# Altium schematic sheet [7] Power.SchDoc: On / Off Controller
size A3; SheetNumber: 7; SheetTotal: 7
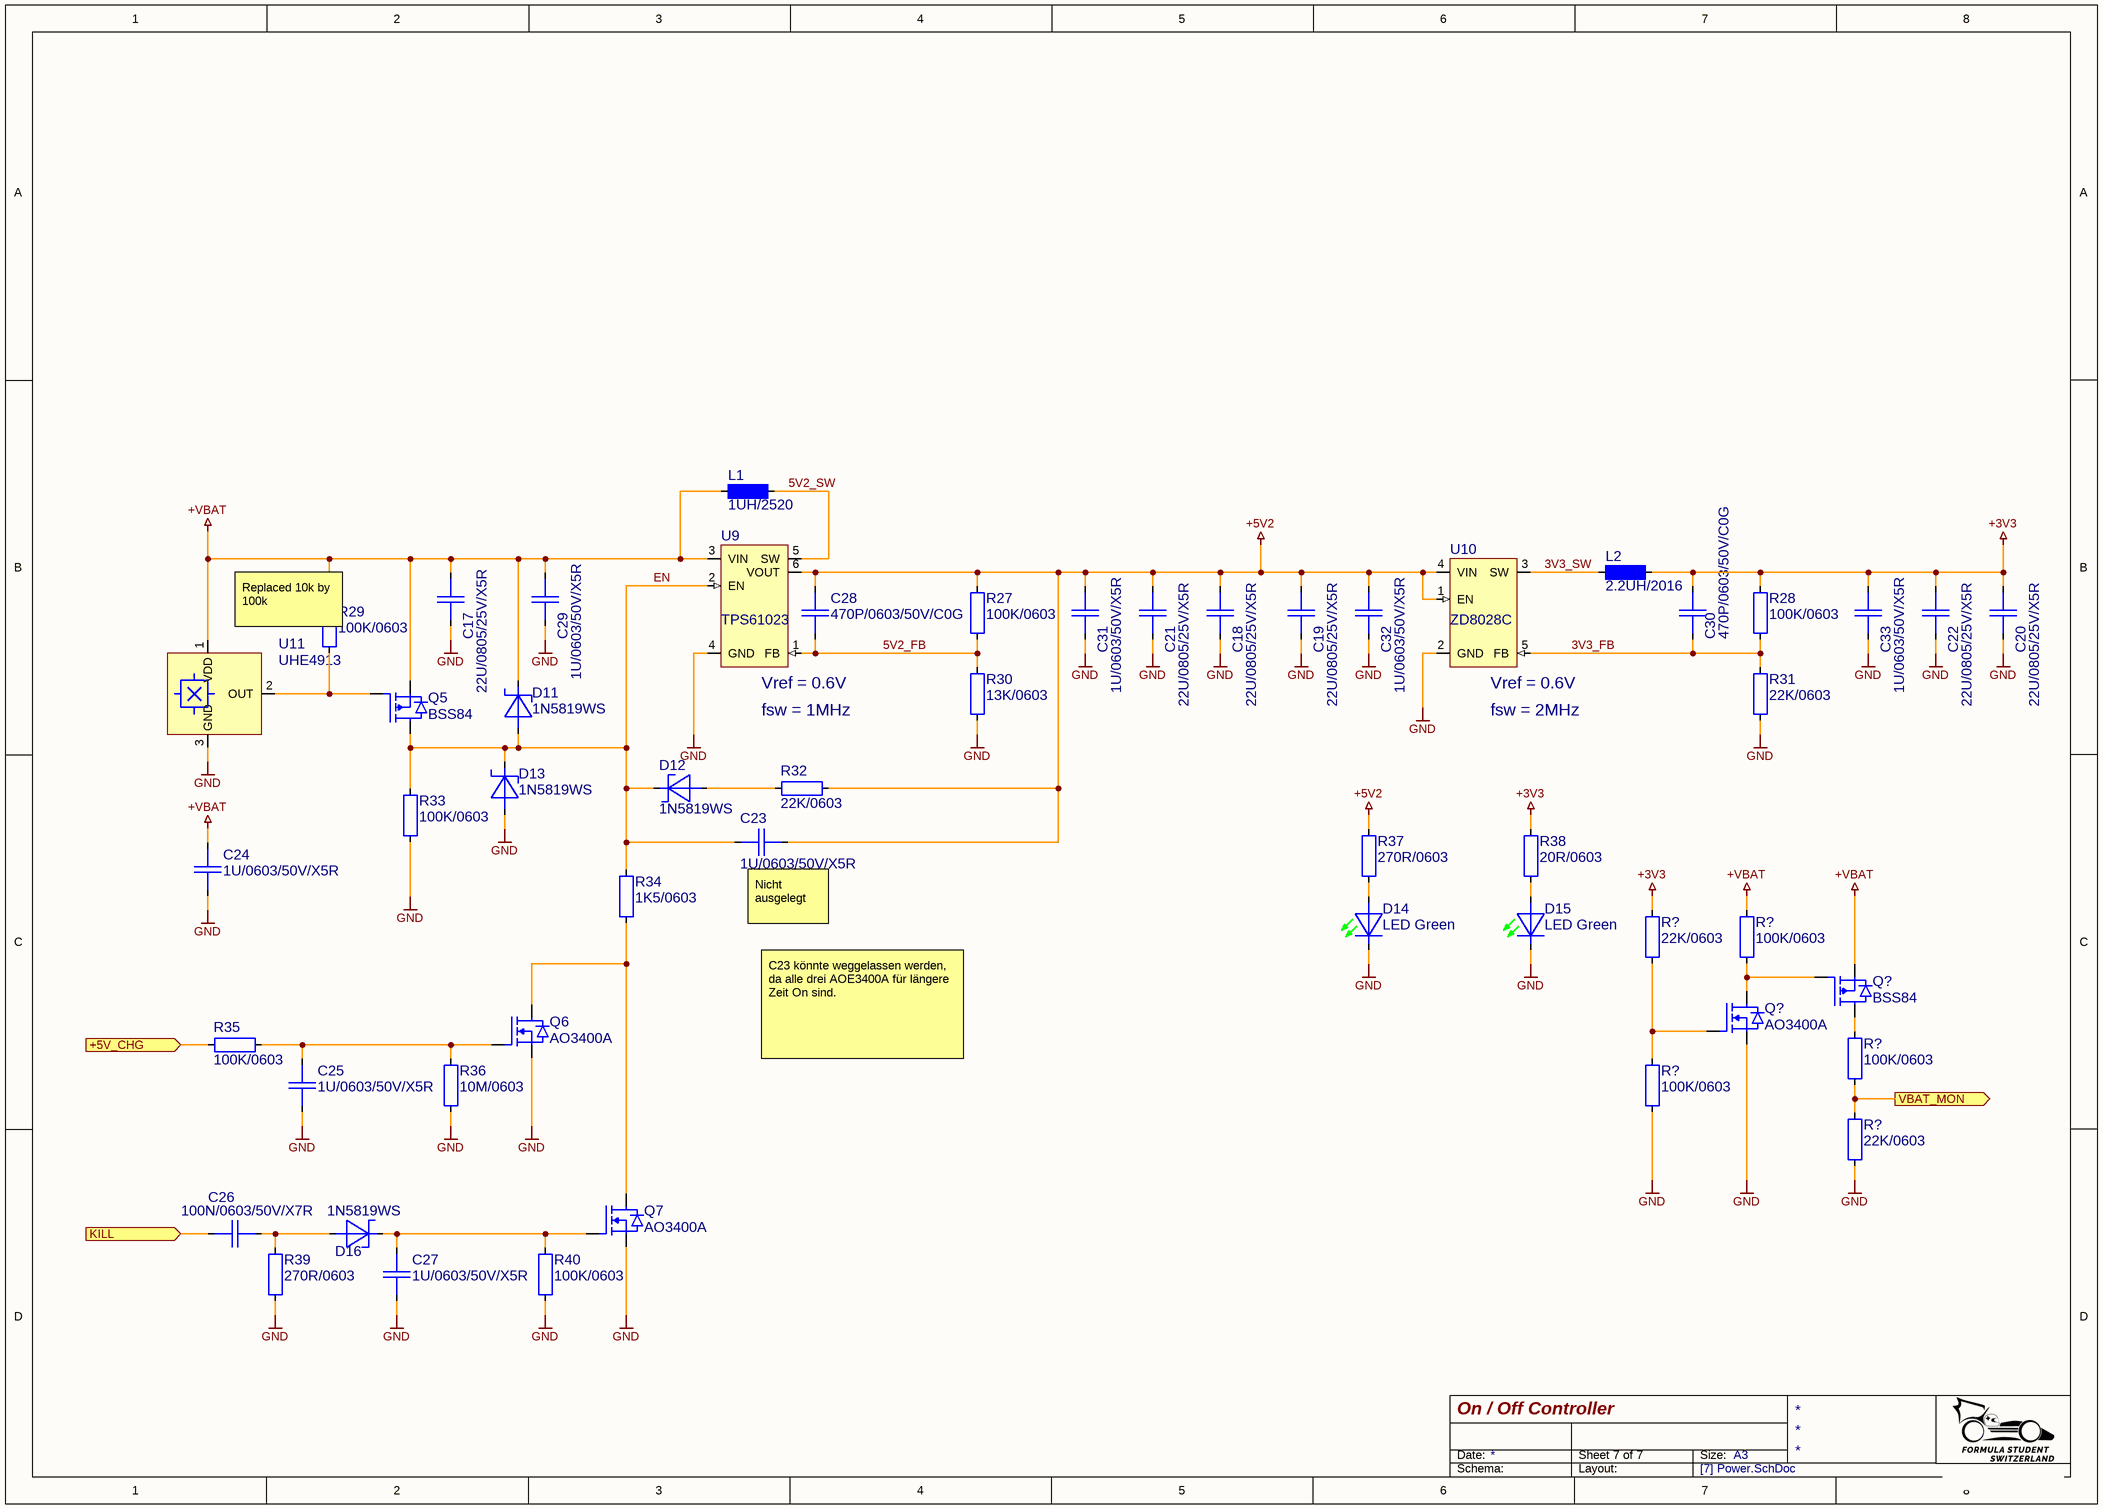
[diagram p0: [7] Power.SchDoc]

## Parts
(Parts that share a designator on the sheet are numbered #1, #2 ... from top to bottom, then left to right.)
C17  22U/0805/25V/X5R  [CAP0805_X7R]
C18  22U/0805/25V/X5R  [CAP0805_X7R]
C19  22U/0805/25V/X5R  [CAP0805_X7R]
C20  22U/0805/25V/X5R  [CAP0805_X7R]
C21  22U/0805/25V/X5R  [CAP0805_X7R]
C22  22U/0805/25V/X5R  [CAP0805_X7R]
C23  1U/0603/50V/X5R  [CAP0603_X7R]
C24  1U/0603/50V/X5R  [CAP0603_X7R]
C25  1U/0603/50V/X5R  [CAP0603_X7R]
C26  100N/0603/50V/X7R  [CAP0603_X7R]
C27  1U/0603/50V/X5R  [CAP0603_X7R]
C28  470P/0603/50V/C0G  [CAP0603_C0G]
C29  1U/0603/50V/X5R  [CAP0603_X7R]
C30  470P/0603/50V/C0G  [CAP0603_C0G]
C31  1U/0603/50V/X5R  [CAP0603_X7R]
C32  1U/0603/50V/X5R  [CAP0603_X7R]
C33  1U/0603/50V/X5R  [CAP0603_X7R]
D11  1N5819WS  [SOD2513X100]
D12  1N5819WS  [SOD2513X100]
D13  1N5819WS  [SOD2513X100]
D14  LED Green  [LED0805_GREEN]
D15  LED Green  [LED0805_GREEN]
D16  1N5819WS  [SOD2513X100]
L1  1UH/2520  [INDM2520X10]
L2  2.2UH/2016  [INDM2016X10]
Q5  BSS84  [SOT2395P280X125-3-SE]
Q6  AO3400A  [SOT2395P280X125-3-SE]
Q7  AO3400A  [SOT2395P280X125-3-SE]
Q?#1  BSS84  [SOT2395P280X125-3-SE]
Q?#2  AO3400A  [SOT2395P280X125-3-SE]
R27  100K/0603  [R0603-0.40-WW]
R28  100K/0603  [R0603-0.40-WW]
R29  100K/0603  [R0603-0.40-WW]
R30  13K/0603  [R0603-0.40-WW]
R31  22K/0603  [R0603-0.40-WW]
R32  22K/0603  [R0603-0.40-WW]
R33  100K/0603  [R0603-0.40-WW]
R34  1K5/0603  [R0603-0.40-WW]
R35  100K/0603  [R0603-0.40-WW]
R36  10M/0603  [R0603-0.40-WW]
R37  270R/0603  [R0603-0.40-WW]
R38  20R/0603  [R0603-0.40-WW]
R39  270R/0603  [R0603-0.40-WW]
R40  100K/0603  [R0603-0.40-WW]
R?#1  22K/0603  [R0603-0.40-WW]
R?#2  100K/0603  [R0603-0.40-WW]
R?#3  100K/0603  [R0603-0.40-WW]
R?#4  100K/0603  [R0603-0.40-WW]
R?#5  22K/0603  [R0603-0.40-WW]
U9  TPS61023  [SOT50P160X60-6-SE]
U10  ZD8028C  [SOT2395P280X125-5-SW]
U11  UHE4913  [SOT2395P280X125-3-SE]

## Ports
+5V_CHG (in), KILL (in), VBAT_MON (out)

## Nets
+3V3: C20.1 C22.1 C30.1 C33.2 L2.2 R28.1 R38.1 R?#1.1
+5V2: C18.1 C19.1 C21.1 C23.2 C28.1 C31.2 C32.2 R27.1 R32.2 R37.1 U9.6(VOUT) U10.1(EN) U10.4(VIN)
+VBAT: C17.1 C24.1 C29.2 D11.1 L1.1 Q5.2(SOURCE) Q?#1.2(SOURCE) R29.1 R?#2.1 U9.3(VIN) U11.1(VDD)
GND: C17.2 C18.2 C19.2 C20.2 C21.2 C22.2 C24.2 C25.2 C27.2 C29.1 C31.1 C32.1 C33.1 D13.2 D14.1 D15.1 Q6.2(SOURCE) Q7.2(SOURCE) Q?#2.2(SOURCE) R30.1 R31.2 R33.2 R36.2 R39.2 R40.2 R?#4.2 R?#5.2 U9.4(GND) U10.2(GND) U11.3(GND)
3V3_FB: C30.2 R28.2 R31.1 U10.5(FB)
3V3_SW: L2.1 U10.3(SW)
5V2_FB: C28.2 R27.2 R30.2 U9.1(FB)
5V2_SW: L1.2 U9.5(SW)
+5V_CHG: R35.1 ; port +5V_CHG
EN: C23.1 D11.2 D12.1 D13.1 Q5.3(DRAIN) R33.1 R34.1 U9.2(EN)
KILL: C26.1 ; port KILL
VBAT_MON: R?#3.2 R?#5.1 ; port VBAT_MON
NetC25_1: C25.1 Q6.1(GATE) R35.2 R36.1
NetC26_2: C26.2 D16.2 R39.1
NetC27_1: C27.1 D16.1 Q7.1(GATE) R40.1
NetD12_2: D12.2 R32.1
NetD14_2: D14.2 R37.2
NetD15_2: D15.2 R38.2
NetQ5_1: Q5.1(GATE) R29.2 U11.2(OUT)
NetQ6_3: Q6.3(DRAIN) Q7.3(DRAIN) R34.2
NetQ?#1_1: Q?#1.1(GATE) Q?#2.3(DRAIN) R?#2.2
NetQ?#1_3: Q?#1.3(DRAIN) R?#3.1
NetQ?#2_1: Q?#2.1(GATE) R?#1.2 R?#4.1

## Notes on the sheet
- (near R29) Replaced 10k by 100k
- (near U9) Vref = 0.6V
- fsw = 1MHz
- (near U10) Vref = 0.6V
- (near U10) fsw = 2MHz
- (near C23) Nicht ausgelegt
- C23 könnte weggelassen werden, da alle drei AOE3400A für längere Zeit On sind.
- Date:
- Size:
- A3
- Schema:
- Layout:

## Library data of the parts
C17-C22 = 22U/0805/25V/X5R: CAP SM 0805 22uF 25V X5R; Manufacturer: GENERIC; Absolute Value: 2.2E-5; Part Number: 22U/0805/25V/X5R; Package: 805; Value: 22uF; Manufacturer Part Number 3: CL21A226MAQNNNE; Supplier 3: LCSC; Supplier Part Number 3: C45783; JLC Type: Basic
C23-C25 C27 C29 C31-C33 = 1U/0603/50V/X5R: CAP SM 0603 1.0uF 50V X5R; Manufacturer: GENERIC; Absolute Value: 1E-6; Part Number: 1U/0603/50V/X5R; Package: 603; Value: 1.0uF; Manufacturer Part Number 3: CL10A105KB8NNNC; Supplier 3: LCSC; Supplier Part Number 3: C15849; JLC Type: Basic
C26 = 100N/0603/50V/X7R: CAP SM 0603 100nF 50V X7R; Manufacturer: GENERIC; Manufacturer 1: YAGEO; Manufacturer Part Number 1: CC0603KPX7R9BB104; Absolute Value: 1E-7; Part Number: 100N/0603/50V/X7R; Package: 603; Value: 100nF; HelpURL: https://www.yageo.com/upload/media/product/app/datasheet/mlcc/upy-gphc_x7r_6_3v-to-250v.pdf; Supplier 1: Digi-Key; Supplier Part Number 1: 311-3567-1-ND; Manufacturer 2: YAGEO; Manufacturer Part Number 2: CC0603MRX7R9BB104; Supplier 2: Digi-Key; Supplier Part Number 2: 311-4110-1-ND; Manufacturer Part Number 3: CC0603KRX7R9BB104; Supplier 3: LCSC; Supplier Part Number 3: C14663; JLC Type: Basic
C28 C30 = 470P/0603/50V/C0G: CAP SM 0603 470pF 50V C0G; Manufacturer: GENERIC; Manufacturer 1: YAGEO; Manufacturer Part Number 1: CC0603JRNPO9BN471; Absolute Value: 4.7E-10; Part Number: 470P/0603/50V/C0G; Package: 603; Value: 470pF; HelpURL: https://www.yageo.com/upload/media/product/productsearch/datasheet/mlcc/UPY-GP_NP0_16V-to-50V_18.pdf; Supplier 1: Digi-Key; Supplier Part Number 1: 311-1520-1-ND; Manufacturer 2: YAGEO; Manufacturer Part Number 2: CC0603KRNPO9BN471; Supplier 2: Digi-Key; Supplier Part Number 2: 311-4038-1-ND; Manufacturer Part Number 3: GCM1885C1H471JA16D; Supplier 3: LCSC; Supplier Part Number 3: C126566; JLC Type: Extended
D11-D13 D16 = 1N5819WS: 40V 600mV@1A 1A SOD-323 Schottky Barrier Diodes (SBD) ROHS; Manufacturer: GENERIC; Part Number: 1N5819WS; Package: SOD323; Value: 1N5819WS; Absolute Value: 40V; HelpURL: https://datasheet.lcsc.com/lcsc/2204281430_Guangdong-Hottech-1N5819WS_C191023.pdf; Manufacturer 3: Guangdong Hottech; Manufacturer Part Number 3: 1N5819WS; Supplier 3: LCSC; Supplier Part Number 3: C191023; JLC Type: Basic
D14 D15 = LED Green 0805: Generic LED Green 0805; Manufacturer 1: Würth; Manufacturer Part Number 1: 150080GS75000; Part Number: LED Green 0805; Manufacturer: GENERIC; Package: 805; Value: Green; Absolute Value: Green; HelpURL: https://www.we-online.com/katalog/datasheet/150060VS75000.pdf; Supplier 1: Digi-Key; Supplier Part Number 1: 732-4983-1-ND; Manufacturer 3: Hubei KENTO Elec; Manufacturer Part Number 3: KT-0805G; Supplier 3: LCSC; Supplier Part Number 3: C2297; JLC Type: Basic
L1 = 1UH/2520: 1UH 2520 Shielded Inductor SMD; Manufacturer: GENERIC; Manufacturer 1: INPAQ Technology Co., Ltd; Manufacturer Part Number 1: WIP252010S-1R0MLDG; Absolute Value: 1E-6; Part Number: 1UH/2520; Package: 2520 metric; Value: 1UH; HelpURL: https://mm.digikey.com/Volume0/opasdata/d220001/medias/docus/5561/WIP252010S%20L%20Series.pdf; Supplier 1: Digi-Key; Supplier Part Number 1: 3526-WIP252010S-1R0MLDGCT-ND; Manufacturer 3: INPAQ; Manufacturer Part Number 3: WIP252012P-1R0ML; Supplier 3: LCSC; Supplier Part Number 3: C315711; JLC Type: Extended
L2 = 2.2UH/2016: 2.2UH 2016 Shielded Inductor SMD; Manufacturer: GENERIC; Manufacturer 1: INPAQ Technology Co., Ltd; Manufacturer Part Number 1: WIP201610S-2R2MLDG; Absolute Value: 2.2E-6; Part Number: 2.2UH/2016; Package: 2016 metric; Value: 2.2UH; HelpURL: https://mm.digikey.com/Volume0/opasdata/d220001/medias/docus/5561/WIP201610S%20L%20Series.pdf; Supplier 1: Digi-Key; Supplier Part Number 1: 3526-WIP201610S-2R2MLDGCT-ND; Manufacturer 3: INPAQ; Manufacturer Part Number 3: WIP201610P-2R2ML; Supplier 3: LCSC; Supplier Part Number 3: C315717; JLC Type: Extended
Q5 Q?#1 = BSS84: 50V P-Channel MOSFET; Manufacturer: GENERIC; Manufacturer 1: Good-Ark Semiconductor; Part Number: BSS84; Package: SOT23; HelpURL: https://goodarksemi.com/docs/datasheets/mosfets/BSS84.pdf; Manufacturer Part Number 1: BSS84; Supplier 1: Digi-Key; Supplier Part Number 1: 4786-BSS84CT-ND; Manufacturer 3: Jiangsu Changjing Electronics Technology Co., Ltd.; Manufacturer Part Number 3: BSS84; Supplier 3: LCSC; Supplier Part Number 3: C114481; JLC Type: Extended
Q6 Q7 Q?#2 = AO3400A: 30V N-Channel MOSFET; Manufacturer: Alpha & Omega Semiconductor; Part Number: AO3400A; Package: SOT23; HelpURL: https://aosmd.com/res/data_sheets/AO3400A.pdf; Manufacturer 3: Alpha & Omega Semiconductor; Manufacturer Part Number 3: AO3400A; Supplier 3: LCSC; Supplier Part Number 3: C20917; JLC Type: Basic
R27-R29 R33 R35 R40 R?#2-R?#4 = 100K/0603: RES SM 0603 100K; Manufacturer: GENERIC; Manufacturer 1: YAGEO; Manufacturer Part Number 1: RC0603FR-13100KL; Absolute Value: 100000; Part Number: 100K/0603; Package: 0603; Value: 100K; HelpURL: https://www.yageo.com/upload/media/product/productsearch/datasheet/rchip/PYu-RC_Group_51_RoHS_L_12.pdf; Supplier 1: Digi-Key; Supplier Part Number 1: 13-RC0603FR-13100KLCT-ND; Manufacturer 2: YAGEO; Manufacturer Part Number 2: RC0603FR-10100KL; Supplier 2: Digi-Key; Supplier Part Number 2: 13-RC0603FR-10100KLCT-ND; Manufacturer 3: UNI-ROYAL(Uniroyal Elec); Manufacturer Part Number 3: 0603WAF1003T5E; Supplier 3: LCSC; Supplier Part Number 3: C25803; JLC Type: Basic
R30 = 13K/0603: RES SM 0603 13K; Manufacturer: GENERIC; Manufacturer 1: YAGEO; Manufacturer Part Number 1: RC0603FR-1313KL; Absolute Value: 13000; Part Number: 13K/0603; Package: 0603; Value: 13K; HelpURL: https://www.yageo.com/upload/media/product/productsearch/datasheet/rchip/PYu-RC_Group_51_RoHS_L_12.pdf; Supplier 1: Digi-Key; Supplier Part Number 1: 13-RC0603FR-1313KLCT-ND; Manufacturer 2: YAGEO; Manufacturer Part Number 2: RC0603FR-1013KL; Supplier 2: Digi-Key; Supplier Part Number 2: 13-RC0603FR-1013KLCT-ND; Manufacturer 3: UNI-ROYAL(Uniroyal Elec); Manufacturer Part Number 3: 0603WAF1302T5E; Supplier 3: LCSC; Supplier Part Number 3: C22797; JLC Type: Basic
R31 R32 R?#1 R?#5 = 22K/0603: RES SM 0603 22K; Manufacturer: GENERIC; Manufacturer 1: YAGEO; Manufacturer Part Number 1: RC0603FR-1322KL; Absolute Value: 22000; Part Number: 22K/0603; Package: 0603; Value: 22K; HelpURL: https://www.yageo.com/upload/media/product/app/datasheet/rchip/pyu-rc_group_51_rohs_l.pdf; Supplier 1: Digi-Key; Supplier Part Number 1: 13-RC0603FR-1322KLCT-ND; Manufacturer 2: YAGEO; Manufacturer Part Number 2: RC0603FR-1022KL; Supplier 2: Digi-Key; Supplier Part Number 2: 13-RC0603FR-1022KLCT-ND; Manufacturer 3: UNI-ROYAL(Uniroyal Elec); Manufacturer Part Number 3: 0603WAF2202T5E; Supplier 3: LCSC; Supplier Part Number 3: C31850; JLC Type: Basic
R34 = 1K5/0603: RES SM 0603 1K5; Manufacturer: GENERIC; Manufacturer 1: YAGEO; Manufacturer Part Number 1: RC0603FR-131K5L; Absolute Value: 1500; Part Number: 1K5/0603; Package: 0603; Value: 1K5; HelpURL: https://www.yageo.com/upload/media/product/app/datasheet/rchip/pyu-rc_group_51_rohs_l.pdf; Supplier 1: Digi-Key; Supplier Part Number 1: 13-RC0603FR-131K5LCT-ND; Manufacturer 2: YAGEO; Manufacturer Part Number 2: RC0603FR-101K5L; Supplier 2: Digi-Key; Supplier Part Number 2: 13-RC0603FR-101K5LCT-ND; Manufacturer 3: UNI-ROYAL(Uniroyal Elec); Manufacturer Part Number 3: 0603WAF1501T5E; Supplier 3: LCSC; Supplier Part Number 3: C22843; JLC Type: Basic
R36 = 10M/0603: RES SM 0603 10M; Manufacturer: GENERIC; Manufacturer 1: YAGEO; Manufacturer Part Number 1: RC0603FR-1310ML; Absolute Value: 10000000; Part Number: 10M/0603; Package: 603; Value: 10M; HelpURL: https://www.yageo.com/upload/media/product/productsearch/datasheet/rchip/PYu-RC_Group_51_RoHS_L_12.pdf; Supplier 1: Digi-Key; Supplier Part Number 1: 13-RC0603FR-1310MLCT-ND; Manufacturer 2: YAGEO; Manufacturer Part Number 2: RC0603FR-1010ML; Supplier 2: Digi-Key; Supplier Part Number 2: 13-RC0603FR-1010MLCT-ND; Manufacturer 3: UNI-ROYAL(Uniroyal Elec); Manufacturer Part Number 3: 0603WAF1005T5E; Supplier 3: LCSC; Supplier Part Number 3: C7250; JLC Type: Basic
R37 R39 = 270R/0603: RES SM 0603 270R; Manufacturer: GENERIC; Manufacturer 1: YAGEO; Manufacturer Part Number 1: RC0603FR-13270RL; Absolute Value: 270; Part Number: 270R/0603; Package: 0603; Value: 270R; HelpURL: https://www.yageo.com/upload/media/product/productsearch/datasheet/rchip/PYu-RC_Group_51_RoHS_L_12.pdf; Supplier 1: Digi-Key; Supplier Part Number 1: 13-RC0603FR-13270RLCT-ND; Manufacturer 2: YAGEO; Manufacturer Part Number 2: RC0603FR-10270RL; Supplier 2: Digi-Key; Supplier Part Number 2: 13-RC0603FR-10270RLCT-ND; Manufacturer 3: UNI-ROYAL(Uniroyal Elec); Manufacturer Part Number 3: 0603WAF2700T5E; Supplier 3: LCSC; Supplier Part Number 3: C22966; JLC Type: Basic
R38 = 20R/0603: RES SM 0603 20R; Manufacturer: GENERIC; Manufacturer 1: YAGEO; Manufacturer Part Number 1: RC0603FR-1320RL; Absolute Value: 20; Part Number: 20R/0603; Package: 0603; Value: 20R; HelpURL: https://www.yageo.com/upload/media/product/app/datasheet/rchip/pyu-rc_group_51_rohs_l.pdf; Supplier 1: Digi-Key; Supplier Part Number 1: 13-RC0603FR-1320RLCT-ND; Manufacturer 2: YAGEO; Manufacturer Part Number 2: RC0603FR-1020RL; Supplier 2: Digi-Key; Supplier Part Number 2: 13-RC0603FR-1020RLCT-ND; Manufacturer 3: UNI-ROYAL(Uniroyal Elec); Manufacturer Part Number 3: 0603WAF200JT5E; Supplier 3: LCSC; Supplier Part Number 3: C22950; JLC Type: Basic
U9 = TPS61023: 3.7-A Boost Converter with 0.5-V Ultra-low Input Voltage; Manufacturer: Texas Instruments; Part Number: TPS61023; Package: SOT563; HelpURL: https://www.ti.com/lit/ds/symlink/tps61023.pdf; Manufacturer 1: Texas Instruments; Manufacturer Part Number 1: TPS61023; Supplier 1: Digi-Key; Supplier Part Number 1: 296-TPS61023DRLRTR-ND; Manufacturer 3: Texas Instruments; Manufacturer Part Number 3: TPS61023; Supplier 3: LCSC; Supplier Part Number 3: C919459; JLC Type: Extended
U10 = ZD8028C: 1.5A 2MHz 5.5V Synchronous Buck Converter; Manufacturer: Zetta; Part Number: ZD8028C; Package: SOT23-5; HelpURL: https://datasheet.lcsc.com/lcsc/2203221830_Zetta-ZD8028IB5TR_C2928932.pdf; Manufacturer 3: Zetta; Manufacturer Part Number 3: ZD8028IB5TR; Supplier 3: LCSC; Supplier Part Number 3: C2928932; JLC Type: Extended
U11 = UHE4913: Ultra Low Power Hall Switch Open Drain; Manufacturer: UTC(Unisonic Tech); Part Number: UHE4913; Package: SOT23; HelpURL: https://datasheet.lcsc.com/lcsc/1811061532_UTC-Unisonic-Tech-UHE4913G-AE3-R_C86815.pdf; Manufacturer 3: UTC(Unisonic Tech); Manufacturer Part Number 3: UHE4913G-AE3-R; Supplier 3: LCSC; Supplier Part Number 3: C86815; JLC Type: Extended